# Altium schematic sheet DS90UB933TRTVRQ1.SchDoc
size A3; SheetNumber: 5; SheetTotal: 7
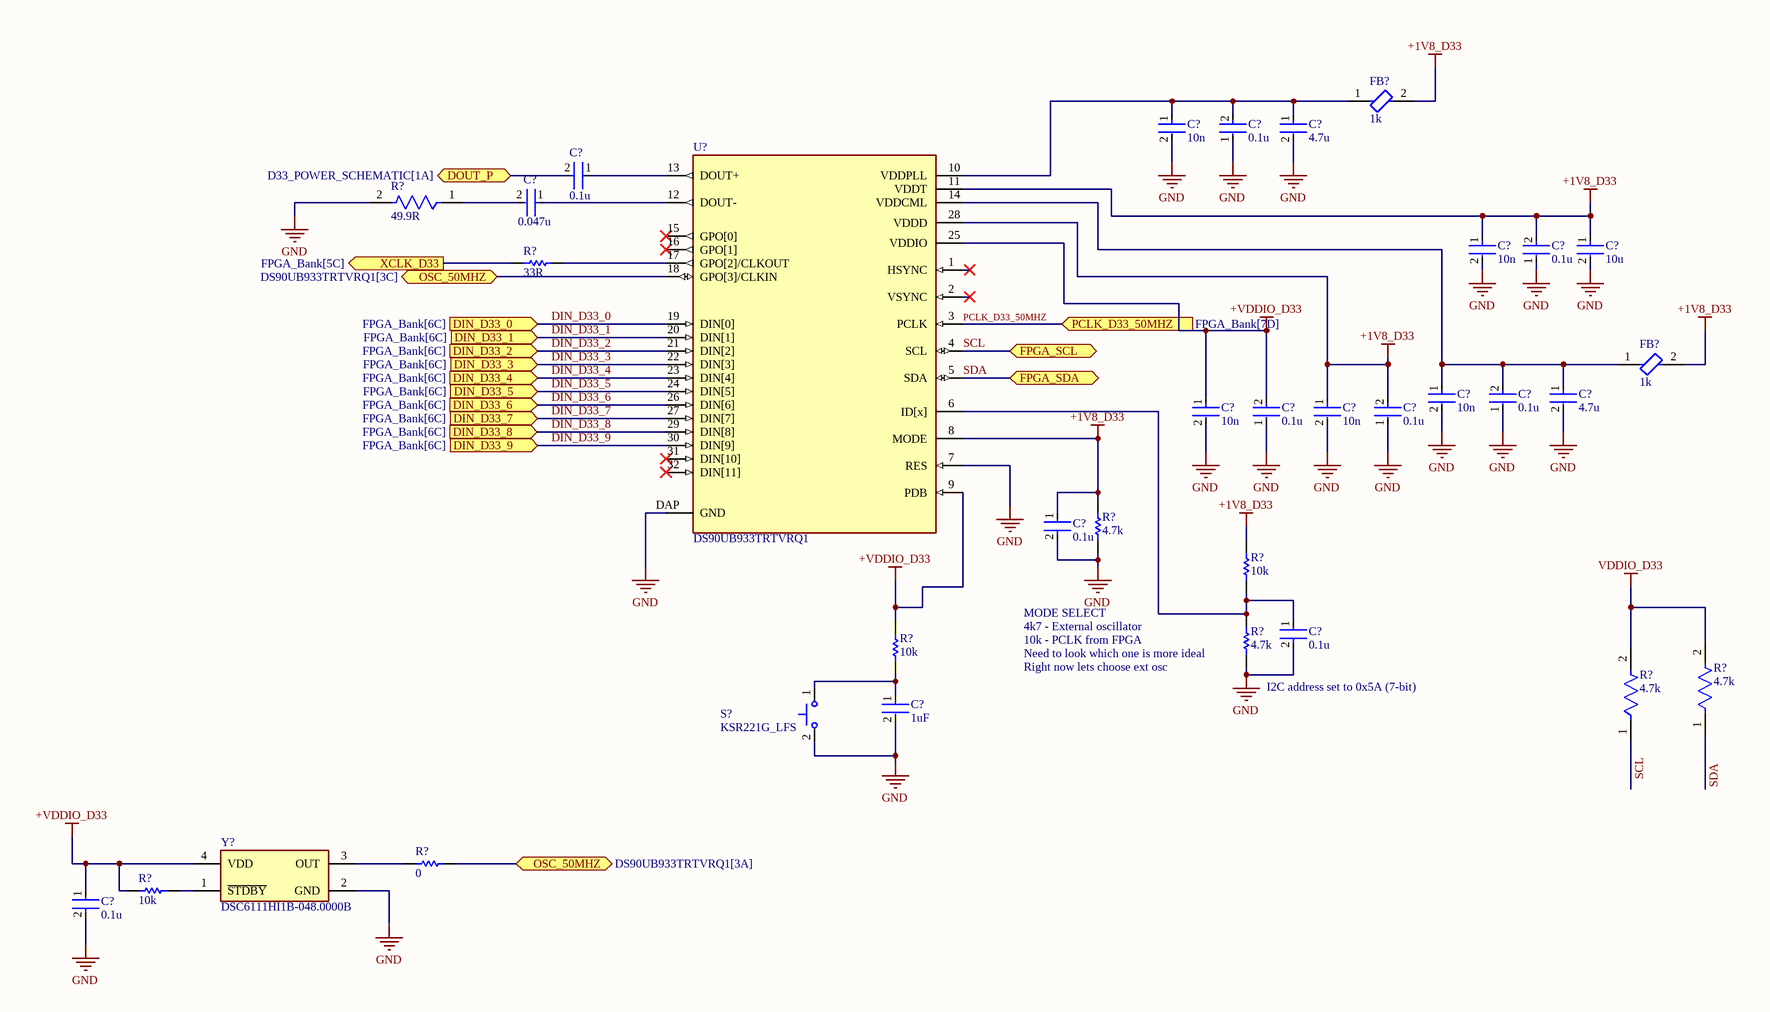
[diagram p0: DS90UB933TRTVRQ1.SchDoc]

## Parts
(Parts that share a designator on the sheet are numbered #1, #2 ... from top to bottom, then left to right.)
C?#1  10n  [FP-GCM155-0_05-IPC_C]
C?#2  0.1u  [FP-GRM15-MFG]
C?#3  4.7u  [FP-GRM188-0_15-IPC_C]
C?#4  0.1u  [FP-GRM15-MFG]
C?#5  0.047u  [FP-C1005-050-0_05-IPC_C]
C?#6  10n  [FP-GCM155-0_05-IPC_C]
C?#7  0.1u  [FP-GRM15-MFG]
C?#8  10u  [FP-GRM188-0_2-MFG]
C?#9  10n  [FP-GCM155-0_05-IPC_C]
C?#10  0.1u  [FP-GRM15-MFG]
C?#11  4.7u  [FP-GRM188-0_15-IPC_C]
C?#12  10n  [FP-GCM155-0_05-IPC_C]
C?#13  0.1u  [FP-GRM15-MFG]
C?#14  10n  [FP-GCM155-0_05-IPC_C]
C?#15  0.1u  [FP-GRM15-MFG]
C?#16  0.1u  [FP-GRM15-MFG]
C?#17  0.1u  [FP-GRM15-MFG]
C?#18  1uF  [FP-C1005-050-0_05-IPC_B]
C?#19  0.1u  [FP-GRM15-MFG]
FB?#1  1k  [FP-BLM15-0_05-IPC_C]
FB?#2  1k  [FP-BLM15-0_05-IPC_C]
R?#1  49.9R  [FP-CRCW0402-e3-MFG]
R?#2  33R  [RESC1005X40X25ML05T05]
R?#3  4.7k  [RESC1005X40X25LL05T05]
R?#4  10k  [RESC1005X40X25ML05T10]
R?#5  4.7k  [RESC1005X40X25LL05T05]
R?#6  10k  [RESC1005X40X25ML05T10]
R?#7  4.7k  [FP-CRCW0402-e3-IPC_A]
R?#8  4.7k  [FP-CRCW0402-e3-IPC_A]
R?#9  0  [RESC1005X40X25LL05T05]
R?#10  10k  [RESC1005X40X25ML05T10]
S?  KSR221G_LFS  [KSR]
U?  DS90UB933TRTVRQ1  [FP-RTV0032A-IPC_A]
Y?  DSC6111HI1B-048.0000B  [DSC6111HI1B0480000B]

## Ports
DIN_D33_0 (in, see FPGA_Bank[6C]), DIN_D33_1 (in, see FPGA_Bank[6C]), DIN_D33_2 (in, see FPGA_Bank[6C]), DIN_D33_3 (in, see FPGA_Bank[6C]), DIN_D33_4 (in, see FPGA_Bank[6C]), DIN_D33_5 (in, see FPGA_Bank[6C]), DIN_D33_6 (in, see FPGA_Bank[6C]), DIN_D33_7 (in, see FPGA_Bank[6C]), DIN_D33_8 (in, see FPGA_Bank[6C]), DIN_D33_9 (in, see FPGA_Bank[6C]), DOUT_P (bidir, see D33_POWER_SCHEMATIC[1A]), FPGA_SCL (bidir, see FPGA_Bank[5A], Serializer_DS90UB913A[6C]), FPGA_SDA (bidir, see FPGA_Bank[5A], Serializer_DS90UB913A[6C]), OSC_50MHZ (bidir, see DS90UB933TRTVRQ1[3A]), OSC_50MHZ (bidir, see DS90UB933TRTVRQ1[3C]), PCLK_D33_50MHZ (in, see FPGA_Bank[7D]), XCLK_D33 (out, see FPGA_Bank[5C])

## Nets
+1V8_D33: C?#6.1 C?#7.2 C?#8.1 C?#14.1 C?#15.2 C?#16.1 FB?#1.2 FB?#2.2 R?#3.2 R?#4.2 U?.8(MODE) U?.11(VDDT) U?.28(VDDD)
+VDDIO_D33: C?#12.1 C?#13.2 C?#19.1 R?#6.2 R?#10.2 U?.9(PDB) U?.25(VDDIO) Y?.4(VDD)
GND: C?#1.2 C?#2.1 C?#3.2 C?#6.2 C?#7.1 C?#8.2 C?#9.2 C?#10.1 C?#11.2 C?#12.2 C?#13.1 C?#14.2 C?#15.1 C?#16.2 C?#17.2 C?#18.2 C?#19.2 R?#1.2 R?#3.1 R?#5.1 S?.2 U?.7(RES) U?.DAP(GND) Y?.2(GND)
VDDIO_D33: R?#7.2 R?#8.2
DIN_D33_0: U?.19(DIN[0]) ; port DIN_D33_0
DIN_D33_1: U?.20(DIN[1]) ; port DIN_D33_1
DIN_D33_2: U?.21(DIN[2]) ; port DIN_D33_2
DIN_D33_3: U?.22(DIN[3]) ; port DIN_D33_3
DIN_D33_4: U?.23(DIN[4]) ; port DIN_D33_4
DIN_D33_5: U?.24(DIN[5]) ; port DIN_D33_5
DIN_D33_6: U?.26(DIN[6]) ; port DIN_D33_6
DIN_D33_7: U?.27(DIN[7]) ; port DIN_D33_7
DIN_D33_8: U?.29(DIN[8]) ; port DIN_D33_8
DIN_D33_9: U?.30(DIN[9]) ; port DIN_D33_9
DOUT_P: C?#4.2 ; port DOUT_P
OSC_50MHZ: R?#9.2 U?.18(GPO[3]/CLKIN) ; port OSC_50MHZ
PCLK_D33_50MHZ: U?.3(PCLK) ; port PCLK_D33_50MHZ
SCL: R?#8.1 U?.4(SCL) ; port FPGA_SCL
SDA: R?#7.1 U?.5(SDA) ; port FPGA_SDA
XCLK_D33: R?#2.1 ; port XCLK_D33
NetC?#1_1: C?#1.1 C?#2.2 C?#3.1 FB?#1.1 U?.10(VDDPLL)
NetC?#4_1: C?#4.1 U?.13(DOUT+)
NetC?#5_1: C?#5.1 U?.12(DOUT-)
NetC?#5_2: C?#5.2 R?#1.1
NetC?#9_1: C?#9.1 C?#10.2 C?#11.1 FB?#2.1 U?.14(VDDCML)
NetC?#17_1: C?#17.1 R?#4.1 R?#5.2 U?.6(ID[x])
NetC?#18_1: C?#18.1 R?#6.1 S?.1
NetR?#2_2: R?#2.2 U?.17(GPO[2]/CLKOUT)
NetR?#9_1: R?#9.1 Y?.3(OUT)
NetR?#10_1: R?#10.1 Y?.1(~{STDBY})

Not connected (* = marked no-connect by the designer): U? 1(HSYNC)* 2(VSYNC)* 15(GPO[0])* 16(GPO[1])* 31(DIN[10])* 32(DIN[11])*

## Notes on the sheet
- MODE SELECT
- `
- 4k7 - External oscillator
- 10k - PCLK from FPGA
- (near R?#5) Need to look which one is more ideal
- (near R?#5) Right now lets choose ext osc
- I2C address set to 0x5A (7-bit)

## Library data of the parts
C?#1 C?#6 C?#9 C?#12 C?#14 = CMP-2008-03723-3: Ceramic Capacitor for Automotive 10nF ±10% 50VDC X7R 0402 Paper T/R; Voltage Rating (DC): 50V; Min Operating Temperature: -55°C; Radiation Hardening: No; Mount: Surface Mount; Thickness: 0.022inch; Package Quantity: 1; Case Code (Imperial): 0402; Lead Free: Lead Free; Case/Package: 0402; Depth: 0.5mm; Termination: SMD/SMT; Tolerance: 10%; Voltage: 50V; Packaging: Tape and Reel; Width: 0.02inch; REACH SVHC: No SVHC; Height: 0.5mm; Max Operating Temperature: 125°C; Case Code (Metric): 1005; Voltage Rating: 50V; Capacitance: 10nF; Ratings: AEC-Q200; Length: 1mm; Dielectric: X7R
C?#2 C?#4 C?#7 C?#10 C?#13 C?#15-C?#17 C?#19 = CMP-2100-03641-2: CAP CER 0.1UF 16V X7R 0402; Manufacturer Part Number: GRM155R71C104KA88D; Manufacturer: Murata; Standoff Height: 0mm; Tolerance: 10%; Voltage Rating: 16Vdc; Material: Ceramic; Capacitance: 0.10μF; Value: 0.10μF; RoHS: TRUE; Temperature Characteristic: X7R; Octopart: https://octopart.com/grm155r71c104ka88d-murata-196880; Digikey Description: CAP CER 0.1UF 16V X7R 0402; Device Class L3: Ceramic Capacitors; Height: 0.55mm; ComponentLink2Description: Datasheet; Temperature Range Low: -55°C; Ipc Land Pattern Name: CAPC10050X219; ComponentLink2URL: https://search.murata.co.jp/Ceramy/image/img/A01X/G101/ENG/GRM155R71H471KA01-01A.pdf; Device Class L1: Passive Components; Lead Free: yes; Category: Cap; Package: GRM15; Temperature: -55°C to +125°C; Device Class L2: Capacitors; Temperature Range High: +125°C; Mouser Description: 0402 0.1 uF 16V ±10 % Tolerance X7R SMT Multilayer Ceramic Capacitor
C?#3 C?#11 = CMP-2006-02523-2: Chip Multilayer Ceramic Capacitors for General Purpose, 0603, 4.7uF, X5R, 15%, 10%, 25V; Case Code (Metric): 1608; Max Operating Temperature: 85°C; REACH SVHC: No SVHC; Voltage Rating: 25V; Dielectric: X5R; Packaging: Cut Tape; Width: 0.031inch; Min Operating Temperature: -55°C; Lead Free: Lead Free; Capacitance: 4.7uF; Height: 0.8mm; Case Code (Imperial): 0603; Length: 1.6mm; Voltage Rating (DC): 25V; Case/Package: 0603; Voltage: 25V; Tolerance: 10%; Thickness: 0.031inch; Mount: Surface Mount; Material: Ceramic; Package Quantity: 4000; Depth: 0.8mm
C?#5 = CMP-2000-06006-2: Multilayer Ceramic Capacitors 47nF ±10% 50V X7R SMD 0402; Dissipation Factor: 5%; Weight: 2.3E-05oz; Max Operating Temperature: 125°C; Package Quantity: 1; Width: 0.02inch; Min Operating Temperature: -55°C; Length: 1mm; Dielectric: X7R; Voltage Rating: 50V; Number of Pins: 2; Lead Free: Lead Free; Voltage: 50V; Dielectric Material: Ceramic; Height: 0.5mm; Case Code (Metric): 1005; Capacitance: 47nF; Voltage Rating (DC): 50V; Construction: Flat; Termination: SMD/SMT; Case Code (Imperial): 0402; Depth: 0.5mm; Packaging: Tape and Reel; Mount: Surface Mount; Series: C; RoHS Compliant: Yes; Tolerance: 10%; Case/Package: 0402; Thickness: 0.022inch; Radiation Hardening: No; Resistor Type: Ceramic; REACH SVHC: No SVHC
C?#8 = CMP-2006-02520-2: Chip Multilayer Ceramic Capacitors for General Purpose, 0603, 10uF, X5R, 15%, 20%, 25V; Tolerance: 20%; Resistor Type: Ceramic; Voltage: 25V; Max Operating Temperature: 85°C; Min Operating Temperature: -55°C; Capacitance: 10uF; Dielectric: X5R; Lead Free: Lead Free; REACH SVHC: No SVHC; Case/Package: 0603; Mount: Surface Mount; Voltage Rating (DC): 25V; Height: 0.8mm; Length: 1.6mm; Thickness: 0.031inch; Width: 0.031inch; Termination: SMD/SMT; Case Code (Imperial): 0603; Case Code (Metric): 1608; Package Quantity: 1; Packaging: Tape and Reel; Depth: 0.8mm; Voltage Rating: 25V; Weight: 0.000222oz; Number of Pins: 2
C?#18 = CMP-2000-06001-2: Multilayer Ceramic Capacitors 1μF ±10% 25V X5R SMD 0402; Package Quantity: 1; Radiation Hardening: No; Dielectric: X5R; REACH SVHC: No SVHC; RoHS Compliant: Yes; Case Code (Imperial): 0402; Voltage Rating: 25V; Termination: SMD/SMT; Max Operating Temperature: 85°C; Capacitance: 1uF; Series: C; Packaging: Tape and Reel; Tolerance: 10%; Voltage Rating (DC): 25V; Weight: 2.3E-05oz; Height: 0.5mm; Resistor Type: Ceramic; Thickness: 0.022inch; Min Operating Temperature: -55°C; Length: 1mm; Lead Free: Lead Free; Depth: 0.5mm; Dielectric Material: Ceramic; Width: 0.02inch; Case/Package: 0402; Case Code (Metric): 1005; Mount: Surface Mount
FB?#1 FB?#2 = CMP-0686-00279-4: Chip Ferrite Bead, 0402, 1000Ω @ 100MHz, 1.25Ω, 25%, 250mA; Manufacturer Series: BLM15H; Number of Functions: 1; DC Resistance-Max: 1.25R; Impedance: 1kR; Shielding: Unshielded; Material: Steel; Series: BLM15H; Case Code (Metric): 1005; Contact Plating: Tin; Width: 0.5mm; Current Rating: 250mA; Number of Circuits: 1; Min Operating Temperature: -55°C; Number of Pins: 2; Core Material: Ferrite; Packaging: Tape and Reel; DC Resistance (DCR): 1.25R; Height: 0.5mm; REACH SVHC: No SVHC; Max Current Rating: 250mA; Depth: 0.5mm; Tolerance: 25%; Termination: SMD/SMT; RoHS Compliant: Yes; Package Quantity: 1; Number of Lines: 1; Max DC Current: 250mA; Radiation Hardening: No; Resistance: 1.25R; Lead Free: Lead Free; DC Current: 250mA; Length: 1mm; Test Frequency: 100MHz; Frequency: 100MHz; Case Code (Imperial): 0402; Max Operating Temperature: 125°C; Case/Package: 0402; Military Standard: Not
R?#1 = CMP-1011-00363-3: RES Thick Film, 49.9Ω, 1%, 0.063W, 100ppm/°C, 0402; Voltage Rating: 50V; Power Rating: 63mW; Temperature Coefficient: 100ppm/°C; Resistance: 49.9R; Packaging: Tape and Reel; Height: 0.35mm; Length: 1mm; Case Code (Metric): 1005; Weight: 2.3E-05oz; Case Code (Imperial): 0402; Voltage Rating (DC): 50V; Composition: Thick Film; Lead Free: Lead Free; Package Quantity: 10; Number of Terminations: 2; Width: 0.5mm; Max Operating Temperature: 155°C; Depth: 0.5mm; Max Power Dissipation: 63mW; Tolerance: 1%; Radiation Hardening: No; Features: Automotive AEC-Q200; Min Operating Temperature: -55°C; Contact Plating: Tin; Mount: Surface Mount; Military Standard: Not; Termination: SMD/SMT; Case/Package: 0402
R?#2 = CMP-2002-08531-1: Manufacturer: Vishay Dale; Part Number: CRCW040233R0JNED
R?#3 R?#5 = CMP-2002-01154-4: Chip Resistor, 4.7 KOhm, +/- 1%, 0.1 W, -55 to 155 degC, 0402 (1005 Metric), RoHS, Tape and Reel; PartNumber: ERJ-2RKF4701X; Voltage Rating: 50 V; Case\/Package: 0402; Power Rating: 100 mW; Height: 0.35 mm; Mounting Technology: Surface Mount; REACH SVHC: Yes; Resistance: 4.7 KOhm; Max Operating Temperature: 155 degC; ComponentLink1Description: Manufacturer URL; ComponentLink2Description: Datasheet; Pins: 2; PackageReference: 0402; Tolerance: 1%; Case Code (Imperial): 0402; Length: 1 mm; PackageDescription: 2-Pin Surface Mount Device, Body 1 x 0.5 mm; RoHSCompliant: true; Package Quantity: 1; Radiation Hardening: No; DatasheetVersion: 04/2015; Width: 0.5 mm; Case Code (Metric): 1005; Mount: Surface Mount; ComponentLink1URL: http://www.panasonic.com/; Min Operating Temperature: -55 degC; Packaging: Cut Tape; ComponentLink2URL: http://industrial.panasonic.com/cdbs/www-data/pdf/RDA0000/AOA0000C86.pdf
R?#4 R?#6 R?#10 = CMP-2002-03043-1: Part Number: CRCW040210K0FKEDHP; Manufacturer: Vishay Dale
R?#7 R?#8 = CMP-2002-00052-3: RES Thick Film, 4.7kΩ, 5%, 0.063W, 200ppm/°C, 0402; Power Rating: 63mW; Resistance: 4.7kR; Voltage Rating: 50V; Case Code (Metric): 1005; Case/Package: 0402; Composition: Thick Film; Depth: 0.5mm; Min Operating Temperature: -55°C; Temperature Coefficient: 200ppm/°C; Max Power Dissipation: 63mW; Packaging: Tape and Reel; Max Operating Temperature: 155°C; Number of Terminations: 2; Width: 0.5mm; Height: 0.35mm; Contact Plating: Tin; Package Quantity: 1; Length: 1mm; Termination: SMD/SMT; Radiation Hardening: No; Weight: 2.3E-05oz; Military Standard: Not; Case Code (Imperial): 0402; Features: Automotive AEC-Q200; Tolerance: 5%
R?#9 = CMP-2000-07451-1: Chip Resistor, 0 Ohm, 0.1 W, -55 to 155 degC, 0402 (1005 Metric), RoHS, Tape and Reel; Manufacturer: Panasonic; Voltage Rating (DC): 50V; Temperature Coefficient: 600ppm/��C; Max Power Dissipation: 100mW; Resistance: 0mOhm; Tolerance: 5%; Number of Terminations: 2; Mount: SurfaceMount; Height: 0.35mm; Packaging: TapeandReel; Contact Plating: Tin; Manufacturer URL: http://www.panasonic.com/; Composition: ThickFilm; Max Operating Temperature: 155degC; REACH SVHC: NoSVHC; Case/Package: 0402; Package Reference: 402; Depth: 0.5mm; Package Description: 2-Pin Surface Mount Device, Body 1 x 0.5 mm; Datasheet URL: https://industrial.panasonic.com/cdbs/www-data/pdf/RDA0000/AOA0000C301.pdf; RoHSCompliant: True; Case Code (Imperial): 0402; Military Standard: Not; Min Operating Temperature: -55degC; Power Rating: 100mW; Datasheet Version: 03/2015; Length: 1mm; Case Code (Metric): 1005; Termination: SMD/SMT; Mounting Technology: SurfaceMount; Voltage Rating: 50V; Width: 0.02inch; Package Quantity: 1; Lead Free: LeadFree; Radiation Hardening: No
S? = KSR221G_LFS: Switch; Manufacturer_Name: C & K COMPONENTS; Manufacturer_Part_Number: KSR221G LFS; Datasheet Link: http://www.ckswitches.com/media/1466/ksr.pdf; Mouser Part Number: 611-KSR221G-LFS; Mouser Price/Stock: https://www.mouser.co.uk/ProductDetail/CK/KSR221G-LFS?qs=nrpkpS80q8EnsbmSijdd7Q%3D%3D; Arrow Part Number: KSR221G LFS; Arrow Price/Stock: https://www.arrow.com/en/products/ksr221glfs/ck?utm_currency=USD&region=europe
U? = CMP-04882-000010-1: IC SERIALIZER FPD-LINK 32WQFN; Number of Inputs: 12; Number of Outputs: 2; RoHS Compliant: Yes; Min Operating Temperature: -40°C; Mount: Surface Mount; Packaging: Tape and Reel; Max Operating Temperature: 105°C
Y? = DSC6111HI1B-048.0000B: Crystal or Oscillator; Manufacturer_Name: Microchip; Datasheet Link: https://ww1.microchip.com/downloads/aemDocuments/documents/TCG/ProductDocuments/DataSheets/DSC61xxB-Ultra-Small-Ultra-Low-Power-MEMS-Oscillator-DS20006155.pdf; Height: 0.89mm; Manufacturer_Part_Number: DSC6111HI1B-048.0000B